# Altium schematic sheet Interfaces.SchDoc
size A4
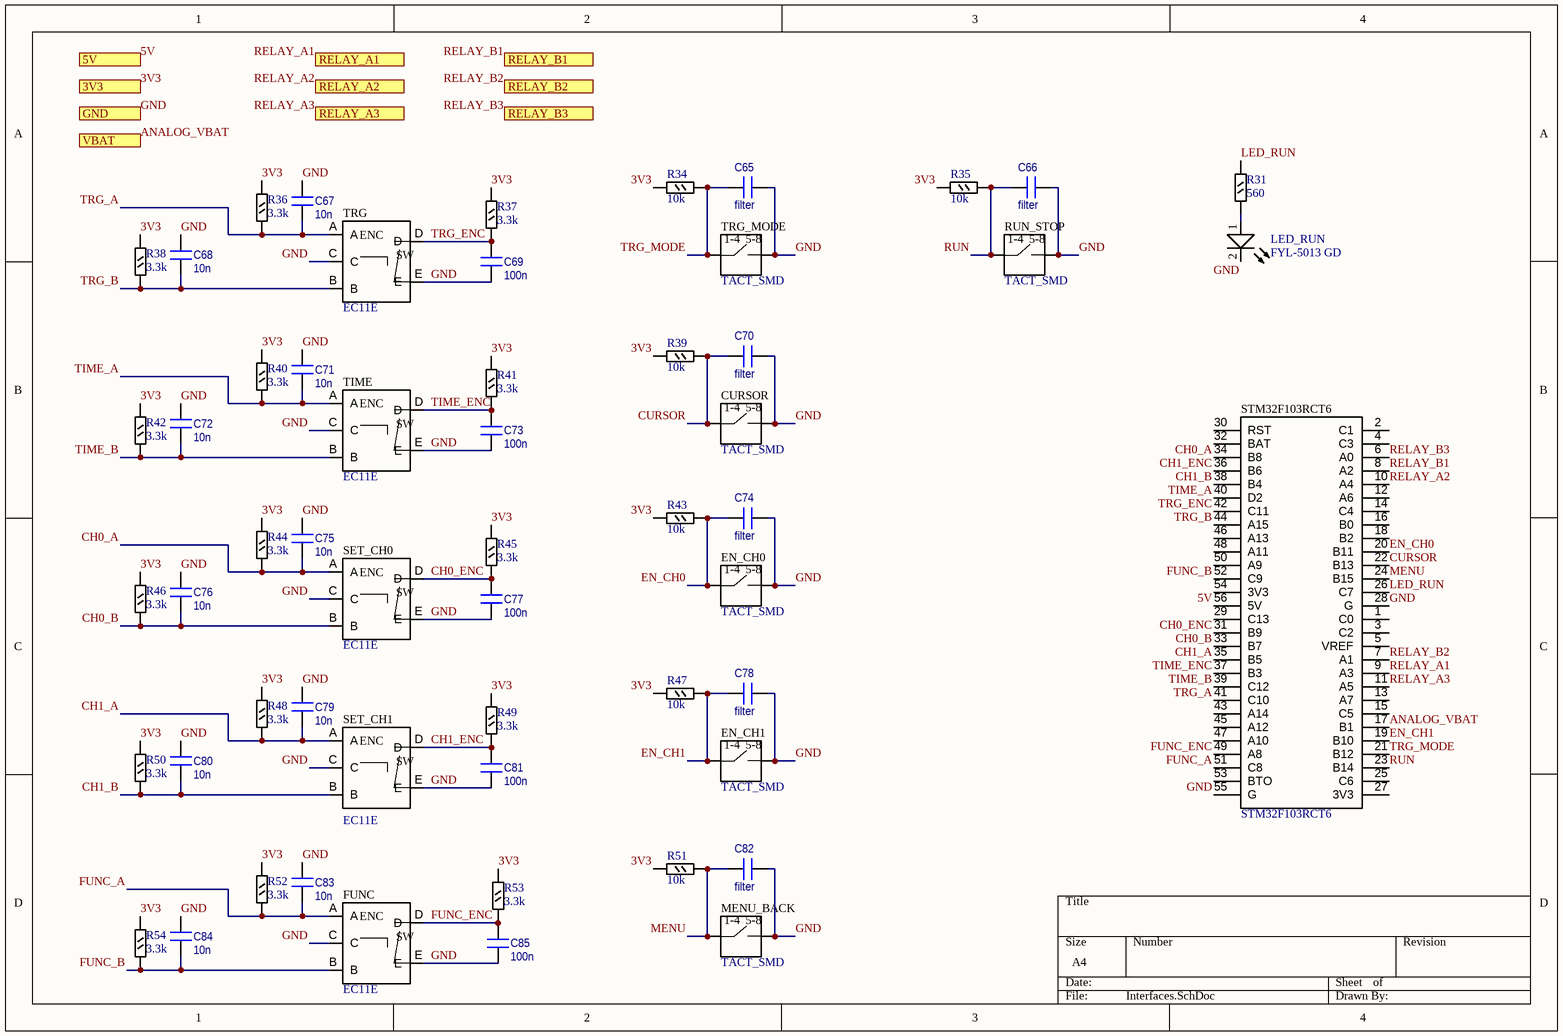
[diagram p0: Interfaces.SchDoc]

## Parts
C65  value filter  [CAPC2012(0805)N]
C66  value filter  [CAPC2012(0805)N]
C67  value 10n  [CAPC2012(0805)N]
C68  value 10n  [CAPC2012(0805)N]
C69  value 100n  [CAPC2012(0805)N]
C70  value filter  [CAPC2012(0805)N]
C71  value 10n  [CAPC2012(0805)N]
C72  value 10n  [CAPC2012(0805)N]
C73  value 100n  [CAPC2012(0805)N]
C74  value filter  [CAPC2012(0805)N]
C75  value 10n  [CAPC2012(0805)N]
C76  value 10n  [CAPC2012(0805)N]
C77  value 100n  [CAPC2012(0805)N]
C78  value filter  [CAPC2012(0805)N]
C79  value 10n  [CAPC2012(0805)N]
C80  value 10n  [CAPC2012(0805)N]
C81  value 100n  [CAPC2012(0805)N]
C82  value filter  [CAPC2012(0805)N]
C83  value 10n  [CAPC2012(0805)N]
C84  value 10n  [CAPC2012(0805)N]
C85  value 100n  [CAPC2012(0805)N]
CURSOR  TACT_SMD  [TACT_SMD_ON_DIP8_RAISED]
EN_CH0  TACT_SMD  [TACT_SMD_ON_DIP8_RAISED]
EN_CH1  TACT_SMD  [TACT_SMD_ON_DIP8_RAISED]
FUNC  EC11E  [EC11E_ENCODER_SW]
LED_RUN  FYL-5013 GD  [LED_3MM_GREEN]
MENU_BACK  TACT_SMD  [TACT_SMD_ON_DIP8_RAISED]
R31  560  [RESC2012(0805)N]
R34  10k  [RESC2012(0805)N]
R35  10k  [RESC2012(0805)N]
R36  3.3k  [RESC2012(0805)N]
R37  3.3k  [RESC2012(0805)N]
R38  3.3k  [RESC2012(0805)N]
R39  10k  [RESC2012(0805)N]
R40  3.3k  [RESC2012(0805)N]
R41  3.3k  [RESC2012(0805)N]
R42  3.3k  [RESC2012(0805)N]
R43  10k  [RESC2012(0805)N]
R44  3.3k  [RESC2012(0805)N]
R45  3.3k  [RESC2012(0805)N]
R46  3.3k  [RESC2012(0805)N]
R47  10k  [RESC2012(0805)N]
R48  3.3k  [RESC2012(0805)N]
R49  3.3k  [RESC2012(0805)N]
R50  3.3k  [RESC2012(0805)N]
R51  10k  [RESC2012(0805)N]
R52  3.3k  [RESC2012(0805)N]
R53  3.3k  [RESC2012(0805)N]
R54  3.3k  [RESC2012(0805)N]
RUN_STOP  TACT_SMD  [TACT_SMD_ON_DIP8_RAISED]
SET_CH0  EC11E  [EC11E_ENCODER_SW]
SET_CH1  EC11E  [EC11E_ENCODER_SW]
STM32F103RCT6  STM32F103RCT6  [STM32F103RCT6_MODULE_PBD_2X14]
TIME  EC11E  [EC11E_ENCODER_SW]
TRG  EC11E  [EC11E_ENCODER_SW]
TRG_MODE  TACT_SMD  [TACT_SMD_ON_DIP8_RAISED]

## Ports
3V3 (in), 5V (in), GND (in), RELAY_A1 (out), RELAY_A2 (out), RELAY_A3 (out), RELAY_B1 (out), RELAY_B2 (out), RELAY_B3 (out), VBAT (in)

## Nets
3V3: R34.2 R35.2 R36.2 R37.2 R38.2 R39.2 R40.2 R41.2 R42.2 R43.2 R44.2 R45.2 R46.2 R47.2 R48.2 R49.2 R50.2 R51.2 R52.2 R53.2 R54.2 ; port 3V3
5V: STM32F103RCT6.56(5V) ; port 5V
ANALOG_VBAT: STM32F103RCT6.17(B1) ; port VBAT
CH0_A: C75.1 R44.1 SET_CH0.A STM32F103RCT6.34(B8)
CH0_B: C76.1 R46.1 SET_CH0.B STM32F103RCT6.33(B7)
CH0_ENC: C77.2 R45.1 SET_CH0.D STM32F103RCT6.31(B9)
CH1_A: C79.1 R48.1 SET_CH1.A STM32F103RCT6.35(B5)
CH1_B: C80.1 R50.1 SET_CH1.B STM32F103RCT6.38(B4)
CH1_ENC: C81.2 R49.1 SET_CH1.D STM32F103RCT6.36(B6)
CURSOR: C70.1 CURSOR.1(A) CURSOR.2(A) CURSOR.3(A) CURSOR.4(A) R39.1 STM32F103RCT6.22(B13)
EN_CH0: C74.1 EN_CH0.1(A) EN_CH0.2(A) EN_CH0.3(A) EN_CH0.4(A) R43.1 STM32F103RCT6.20(B11)
EN_CH1: C78.1 EN_CH1.1(A) EN_CH1.2(A) EN_CH1.3(A) EN_CH1.4(A) R47.1 STM32F103RCT6.19(B10)
FUNC_A: C83.1 FUNC.A R52.1 STM32F103RCT6.51(C8)
FUNC_B: C84.1 FUNC.B R54.1 STM32F103RCT6.52(C9)
FUNC_ENC: C85.2 FUNC.D R53.1 STM32F103RCT6.49(A8)
GND: C65.2 C66.2 C67.2 C68.2 C69.1 C70.2 C71.2 C72.2 C73.1 C74.2 C75.2 C76.2 C77.1 C78.2 C79.2 C80.2 C81.1 C82.2 C83.2 C84.2 C85.1 CURSOR.5(B) CURSOR.6(B) CURSOR.7(B) CURSOR.8(B) EN_CH0.5(B) EN_CH0.6(B) EN_CH0.7(B) EN_CH0.8(B) EN_CH1.5(B) EN_CH1.6(B) EN_CH1.7(B) EN_CH1.8(B) FUNC.C FUNC.E LED_RUN.2(K) MENU_BACK.5(B) MENU_BACK.6(B) MENU_BACK.7(B) MENU_BACK.8(B) RUN_STOP.5(B) RUN_STOP.6(B) RUN_STOP.7(B) RUN_STOP.8(B) SET_CH0.C SET_CH0.E SET_CH1.C SET_CH1.E STM32F103RCT6.28(G) STM32F103RCT6.55(G) TIME.C TIME.E TRG.C TRG.E TRG_MODE.5(B) TRG_MODE.6(B) TRG_MODE.7(B) TRG_MODE.8(B) ; port GND
LED_RUN: R31.2 STM32F103RCT6.26(C7)
MENU: C82.1 MENU_BACK.1(A) MENU_BACK.2(A) MENU_BACK.3(A) MENU_BACK.4(A) R51.1 STM32F103RCT6.24(B15)
RELAY_A1: STM32F103RCT6.9(A3) ; port RELAY_A1
RELAY_A2: STM32F103RCT6.10(A4) ; port RELAY_A2
RELAY_A3: STM32F103RCT6.11(A5) ; port RELAY_A3
RELAY_B1: STM32F103RCT6.8(A2) ; port RELAY_B1
RELAY_B2: STM32F103RCT6.7(A1) ; port RELAY_B2
RELAY_B3: STM32F103RCT6.6(A0) ; port RELAY_B3
RUN: C66.1 R35.1 RUN_STOP.1(A) RUN_STOP.2(A) RUN_STOP.3(A) RUN_STOP.4(A) STM32F103RCT6.23(B14)
TIME_A: C71.1 R40.1 STM32F103RCT6.40(D2) TIME.A
TIME_B: C72.1 R42.1 STM32F103RCT6.39(C12) TIME.B
TIME_ENC: C73.2 R41.1 STM32F103RCT6.37(B3) TIME.D
TRG_A: C67.1 R36.1 STM32F103RCT6.41(C10) TRG.A
TRG_B: C68.1 R38.1 STM32F103RCT6.44(A15) TRG.B
TRG_ENC: C69.2 R37.1 STM32F103RCT6.42(C11) TRG.D
TRG_MODE: C65.1 R34.1 STM32F103RCT6.21(B12) TRG_MODE.1(A) TRG_MODE.2(A) TRG_MODE.3(A) TRG_MODE.4(A)
NetLED_RUN_1: LED_RUN.1(A) R31.1

Not connected (* = marked no-connect by the designer): STM32F103RCT6 1(C0) 2(C1) 3(C2) 4(C3) 5(VREF) 12(A6) 13(A7) 14(C4) 15(C5) 16(B0) 18(B2) 25(C6) 27(3V3) 29(C13) 30(RST) 32(BAT) 43(A14) 45(A12) 46(A13) 47(A10) 48(A11) 50(A9) 53(BTO) 54(3V3)

## Notes on the sheet
- (in symbol EC11E_ENCODER_SW) ENC; SW
- (in symbol TACT_SMD_ON_DIP8_RAISED) 1-4; 5-8

## Library data of the parts
C65-C85 = CAPC2012(0805): Package: 0805; Voltage: *; Part Number: CAPC2012(0805)
CURSOR EN_CH0 EN_CH1 MENU_BACK RUN_STOP TRG_MODE = TACT_SMD_ON_DIP8_RAISED: Custom raised NO tactile switch; pins 1-4 common, pins 5-8 common
FUNC SET_CH0 SET_CH1 TIME TRG = EC11E_ENCODER_SW: Alps Alpine EC11E vertical incremental encoder with one push-on switch
R31 R34-R54 = RESC2012(0805): Part Number: RESC2012(0805); Package: 0805
STM32F103RCT6 = STM32F103RCT6_MODULE_PBD_2X14: STM32F103RCT6 core board, 56 pins, two PBD 2x14 sockets
LED_RUN = FYL-5013 GD: Part Number: FYL-5013 GD